# EasyEDA Pro project ProPrj_Practice 4 layer_2025-09-09.epro, schematic Voltage Output
Board Name: Voltage Output; Create Date: 2025-08-14; Page Name: P1; Project Name: Practice 4 layer; Schematic Name: Voltage Output; Update Date: 2025-08-21; Company: EasyEDA.com; Page Size: A4; Version: V1.0
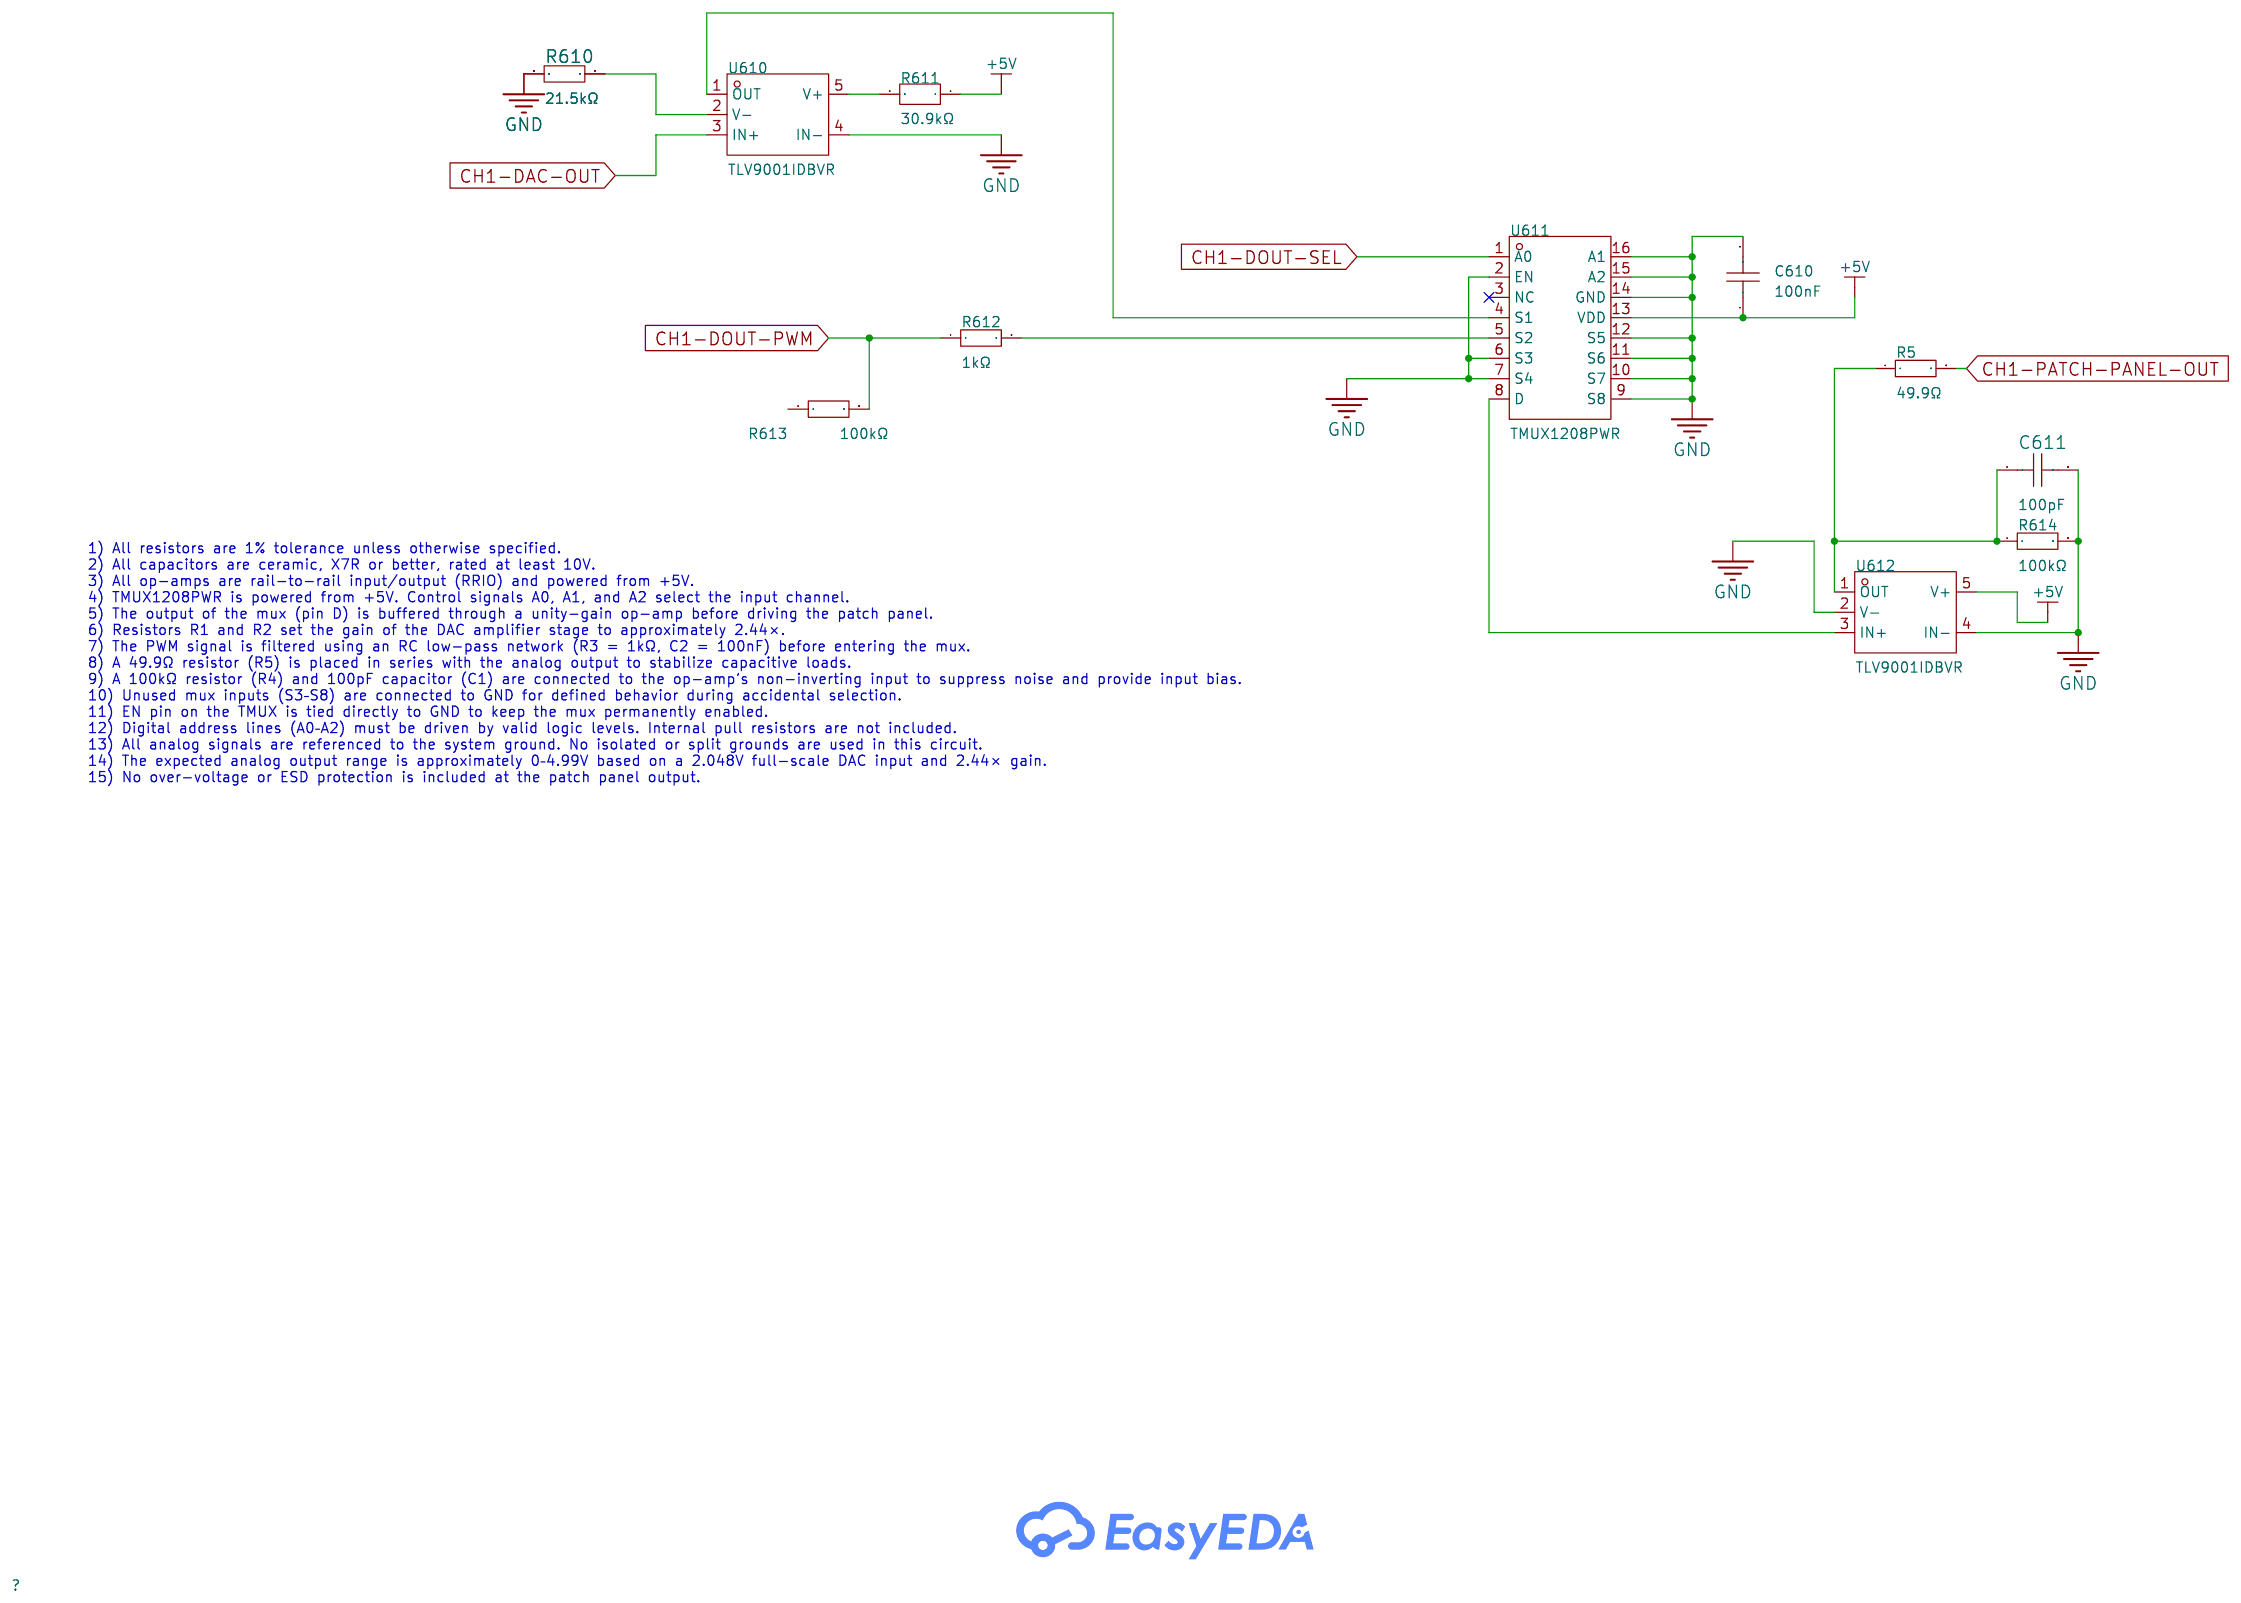
[diagram p9: schematic sheet]

## Parts
C610  100nF  [C0603]
C611  100pF  [C0603]
R5  49.9Ω  [R0603]
R610  21.5kΩ  [R0402]
R611  30.9kΩ  [R0603]
R612  1kΩ  [R0603]
R613  100kΩ  [R0603]
R614  100kΩ  [R0603]
U610  TLV9001IDBVR  [SOT-23-5_L3.0-W1.7-P0.95-LS2.8-BR]
U611  TMUX1208PWR  [TSSOP-16_L5.0-W4.4-P0.65-LS6.4-BL]
U612  TLV9001IDBVR  [SOT-23-5_L3.0-W1.7-P0.95-LS2.8-BR]

## Library data of the parts
C610 = CC0603KRX7R9BB104: Capacitance:100nF Tolerance:±10% Tolerance:±10% Voltage Rating:50V Temperature Coefficient:X7R; LCSC Part Name: 100nF ±10% 50V; Supplier Part: C14663; Manufacturer: YAGEO(国巨); Supplier Footprint: 0603; JLCPCB Part Class: Basic Part; Datasheet: https://atta.szlcsc.com/upload/public/pdf/source/20250214/096C4C206003071F5D32E5F0D8E7F8DF.pdf; Supplier: LCSC; Tolerance: ±10%; Voltage Rating: 50V; Temperature Coefficient: X7R
C611 = CC0603JRNPO9BN101: Capacitance: Tolerance:±5% Tolerance:±5% Voltage Rated: Temperature Coefficient:; LCSC Part Name: 100pF ±5% 50V; Supplier Part: C14665; Manufacturer: YAGEO(国巨); Supplier Footprint: 0603; JLCPCB Part Class: Extended Part; Datasheet: https://atta.szlcsc.com/upload/public/pdf/source/20181008/C309499_21CC21451B82C39E3D92150FD6B30293.pdf; Supplier: LCSC; Tolerance: ±5%
R5 = 0603WAF499JT5E_C23185: Type:Thick Film Resistor Resistance:49.9Ω Tolerance:±1% Tolerance:±1% Power(Watts):100mW Voltage-Supply(Max):75V Temperature Coefficient:±100ppm/℃ Temperature Coefficient:±100ppm/℃ Operating Temperature:-55℃~+155℃ Operating Temperature:-55℃~+155℃; LCSC Part Name: 49.9Ω ±1% 100mW 厚膜电阻; Supplier Part: C23185; Manufacturer: UNI-ROYAL(厚声); Manufacturer Part: 0603WAF499JT5E; Supplier Footprint: 0603; JLCPCB Part Class: Basic Part; Datasheet: https://item.szlcsc.com/datasheet/0603WAF499JT5E/23912.html; Supplier: LCSC; Type: Thick Film Resistor; Tolerance: ±1%; Power(Watts): 100mW; Voltage-Supply(Max): 75V; Temperature Coefficient: ±100ppm/℃; Operating Temperature: -55℃~+155℃
R610 = 0402WGF2152TCE: Type:Thick Film Resistor Resistance:21.5kΩ Tolerance:±1% Tolerance:±1% Power(Watts):62.5mW Voltage-Supply(Max):50V Temperature Coefficient:±100ppm/℃ Temperature Coefficient:±100ppm/℃ Operating Temperature:-55℃~+155℃ Operating Temperature:-55℃~+155℃; LCSC Part Name: 21.5kΩ ±1% 62.5mW 厚膜电阻; Supplier Part: C25872; Manufacturer: UNI-ROYAL(厚声); Supplier Footprint: 0402; JLCPCB Part Class: Extended Part; Datasheet: https://item.szlcsc.com/datasheet/0402WGF2152TCE/26615.html; Supplier: LCSC; Type: Thick Film Resistor; Tolerance: ±1%; Power(Watts): 62.5mW; Voltage-Supply(Max): 50V; Temperature Coefficient: ±100ppm/℃; Operating Temperature: -55℃~+155℃
R611 = FRC0603F3092TS: Type:Thick Film Resistor Resistance:30.9kΩ Tolerance:±1% Tolerance:±1% Power(Watts):100mW Voltage-Supply(Max):75V Temperature Coefficient:±100ppm/℃ Temperature Coefficient:±100ppm/℃ Operating Temperature:-55℃~+155℃ Operating Temperature:-55℃~+155℃; LCSC Part Name: 30.9kΩ ±1% 100mW 厚膜电阻; Supplier Part: C2930090; Manufacturer: FOJAN(富捷); Supplier Footprint: 0603; JLCPCB Part Class: Extended Part; Datasheet: https://item.szlcsc.com/datasheet/FRC0603F3092TS/3267023.html; Supplier: LCSC; Type: Thick Film Resistor; Tolerance: ±1%; Power(Watts): 100mW; Voltage-Supply(Max): 75V; Temperature Coefficient: ±100ppm/℃; Operating Temperature: -55℃~+155℃
R612 = 0603WAJ0102T5E: Type:Thick Film Resistor Resistance:1kΩ Tolerance:±5% Tolerance:±5% Power(Watts):100mW Voltage-Supply(Max):75V Temperature Coefficient:±100ppm/℃ Temperature Coefficient:±100ppm/℃ Operating Temperature:-55℃~+155℃ Operating Temperature:-55℃~+155℃; LCSC Part Name: 1kΩ ±5% 100mW 厚膜电阻; Supplier Part: C25585; Manufacturer: UNI-ROYAL(厚声); Supplier Footprint: 0603; JLCPCB Part Class: Extended Part; Datasheet: https://item.szlcsc.com/datasheet/0603WAJ0102T5E/26328.html; Supplier: LCSC; Type: Thick Film Resistor; Tolerance: ±5%; Power(Watts): 100mW; Voltage-Supply(Max): 75V; Temperature Coefficient: ±100ppm/℃; Operating Temperature: -55℃~+155℃
R613 R614 = 0603WAF1003T5E: Type:Thick Film Resistors Resistance:100kΩ Tolerance:±1% Tolerance:±1% Power(Watts): Overload Voltage (Max): Temperature Coefficient:±100ppm/℃ Temperature Coefficient:±100ppm/℃ Operating Temperature Range:-55℃~+155℃ Operating Temperature Range:-55℃~+155℃; LCSC Part Name: 100kΩ ±1% 100mW 厚膜电阻; Supplier Part: C25803; Manufacturer: UNI-ROYAL(厚声); Supplier Footprint: 0603; JLCPCB Part Class: Basic Part; Datasheet: https://atta.szlcsc.com/upload/public/pdf/source/20200306/C422600_1E6D84923E4A46A82E41ADD87F860B5C.pdf; Supplier: LCSC; Type: Thick Film Resistors; Tolerance: ±1%; Temperature Coefficient: ±100ppm/℃; Operating Temperature Range: -55℃~+155℃
U610 U612 = TLV9001IDBVR: Number of Channels:Single channel Maximum Power Supply Range (Vdd-Vss):5.5V Rail to Rail:- Gain Bandwidth Product:- Vos - Input Offset Voltage:1.6mV Input Offset Voltage Drift(Vos TC):0.6uV/℃ Slew Rate:2V/us Ib - Input Bias Current:5pA Input Offset Curren; Supplier Part: C398363; Manufacturer: TI(德州仪器); Supplier Footprint: SOT-23-5; JLCPCB Part Class: Extended Part; Datasheet: https://www.ti.com/cn/lit/gpn/tlv9001; Supplier: LCSC; Number of Channels: Single channel; Maximum Power Supply Range (Vdd-Vss): 5.5V; Vos - Input Offset Voltage: 1.6mV; Input Offset Voltage Drift(Vos TC): 0.6uV/℃; Slew Rate: 2V/us; Ib - Input Bias Current: 5pA; Noise density(eN): 4.7nV/√Hz@1kHz; Common Mode Rejection Ratio(CMRR): 86dB; Operating Temperature: -40℃~+125℃; Single supply: 1.8V~5.5V
U611 = TMUX1208PWR: Switch Circuit:SP8T single pole eight throw Number of Channels:8 Supply Voltage:1.08V~5.5V Supply Voltage:1.08V~5.5V Turn-on time:48ns On-State Resistance (Max):9Ω Turn-off time:48ns Operating Temperature:-40℃~+125℃ Operating Temperature:-40℃~+125℃; LCSC Part Name: TMUX1208 5V 双向8:1单通道多路复用器; Supplier Part: C494728; Manufacturer: TI(德州仪器); Supplier Footprint: TSSOP-16; JLCPCB Part Class: Extended Part; Datasheet: https://www.ti.com/cn/lit/gpn/tmux1208; Supplier: LCSC; Switch Circuit: SP8T single pole eight throw; Number of Channels: 8; Supply Voltage: 1.08V~5.5V; Turn-on time: 48ns; On-State Resistance (Max): 9Ω; Turn-off time: 48ns; Operating Temperature: -40℃~+125℃

## Nets
+5V: C610.1 R611.1 U611.13(VDD) U612.5(V+)
GND: C610.2 C611.2 R610.2 R614.2 U610.4(IN-) U611.2(EN) U611.6(S3) U611.7(S4) U611.9(S8) U611.10(S7) U611.11(S6) U611.12(S5) U611.14(GND) U611.15(A2) U611.16(A1) U612.2(V-) U612.4(IN-)
CH1-DAC-OUT: U610.3(IN+)
CH1-DOUT-PWM: R612.1 R613.2
CH1-DOUT-SEL: U611.1(A0)
CH1-PATCH-PANEL-OUT: R5.2
T_U2V+: R611.2 U610.5(V+)
T_U2V-: R610.1 U610.2(V-)
T_U5D: U611.8(D) U612.3(IN+)
T_U5S1: U610.1(OUT) U611.4(S1)
T_U5S2: R612.2 U611.5(S2)
T_U6OUT: C611.1 R5.1 R614.1 U612.1(OUT)

Not connected (* = marked no-connect by the designer): R613 1; U611 3(NC)*

## Notes on the sheet
- 1) All resistors are 1% tolerance unless otherwise specified.
  2) All capacitors are ceramic, X7R or better, rated at least 10 V.
  3) All op-amps are rail-to-rail input/output (RRIO) and powered from +5 V.
  4) TMUX1208PWR is powered from +5 V. Control signals A0, A1, and A2 select the input channel.
  5) The output of the mux (pin D) is buffered through a unity-gain op-amp before driving the patch panel.
  6) Resistors R1 and R2 set the gain of the DAC amplifier stage to approximately 2.44×.
  7) The PWM signal is filtered using an RC low-pass network (R3 = 1 kΩ, C2 = 100 nF) before entering the mux.
  8) A 49.9 Ω resistor (R5) is placed in series with the analog output to stabilize capacitive loads.
  9) A 100 kΩ resistor (R4) and 100 pF capacitor (C1) are connected to the op-amp’s non-inverting input to suppress noise and provide input bias.
  10) Unused mux inputs (S3–S8) are connected to GND for defined behavior during accidental selection.
  11) EN pin on the TMUX is tied directly to GND to keep the mux permanently enabled.
  12) Digital address lines (A0–A2) must be driven by valid logic levels. Internal pull resistors are not included.
  13) All analog signals are referenced to the system ground. No isolated or split grounds are used in this circuit.
  14) The expected analog output range is approximately 0–4.99 V based on a 2.048 V full-scale DAC input and 2.44× gain.
  15) No over-voltage or ESD protection is included at the patch panel output.
